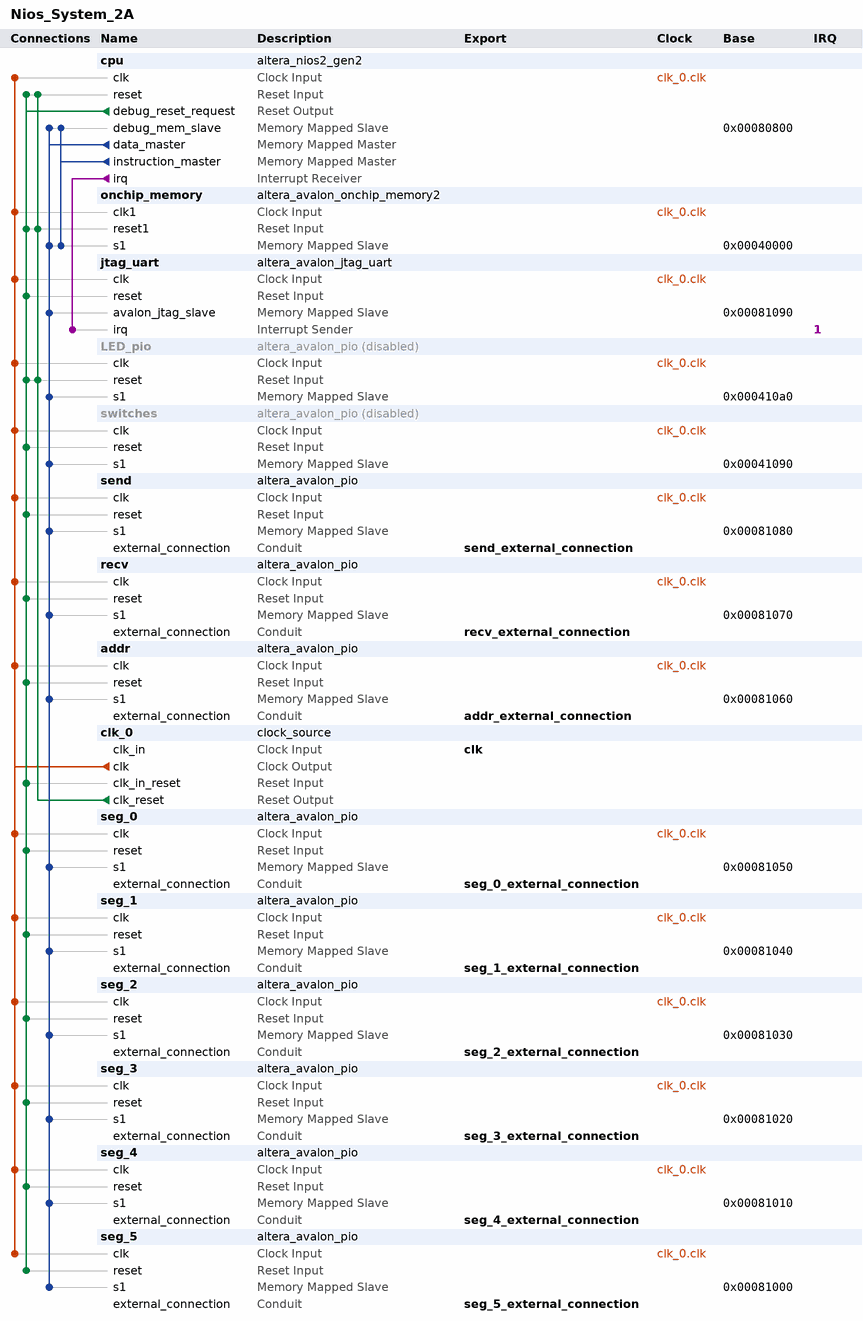
[diagram p0: system contents]
# Platform Designer (Qsys) system Nios_System_2A, Cyclone V 5CSEMA5F31C6
# Parameters at their usual value, and those the tool derives, are not listed.
package require -exact qsys 18.1
create_system Nios_System_2A
set_project_property DEVICE_FAMILY {Cyclone V}
set_project_property DEVICE 5CSEMA5F31C6

add_instance cpu altera_nios2_gen2 18.1
set_instance_parameter_value cpu cpuID 1
set_instance_parameter_value cpu dcache_size 4096
set_instance_parameter_value cpu exceptionSlave onchip_memory.s1
set_instance_parameter_value cpu icache_size 8192
set_instance_parameter_value cpu impl Fast
set_instance_parameter_value cpu resetSlave onchip_memory.s1

add_instance onchip_memory altera_avalon_onchip_memory2 18.1
set_instance_parameter_value onchip_memory dataWidth 32
set_instance_parameter_value onchip_memory dualPort false
set_instance_parameter_value onchip_memory initMemContent true
set_instance_parameter_value onchip_memory initializationFileName onchip_mem.hex
set_instance_parameter_value onchip_memory memorySize 160000

add_instance jtag_uart altera_avalon_jtag_uart 18.1
set_instance_parameter_value jtag_uart simInteractiveOptions NO_INTERACTIVE_WINDOWS

add_instance LED_pio altera_avalon_pio 18.1
set_instance_property LED_pio ENABLED false
set_instance_parameter_value LED_pio direction Output
set_instance_parameter_value LED_pio width 8

add_instance switches altera_avalon_pio 18.1
set_instance_property switches ENABLED false
set_instance_parameter_value switches direction Input
set_instance_parameter_value switches width 8

add_instance send altera_avalon_pio 18.1
set_instance_parameter_value send direction Output
set_instance_parameter_value send width 32

add_instance recv altera_avalon_pio 18.1
set_instance_parameter_value recv direction Input
set_instance_parameter_value recv width 32

add_instance addr altera_avalon_pio 18.1
set_instance_parameter_value addr direction Output
set_instance_parameter_value addr width 8

add_instance clk_0 clock_source 18.1
set_instance_parameter_value clk_0 clockFrequency 50000000

add_instance seg_0 altera_avalon_pio 18.1
set_instance_parameter_value seg_0 direction Output
set_instance_parameter_value seg_0 width 8

add_instance seg_1 altera_avalon_pio 18.1
set_instance_parameter_value seg_1 direction Output
set_instance_parameter_value seg_1 width 8

add_instance seg_2 altera_avalon_pio 18.1
set_instance_parameter_value seg_2 direction Output
set_instance_parameter_value seg_2 width 8

add_instance seg_3 altera_avalon_pio 18.1
set_instance_parameter_value seg_3 direction Output
set_instance_parameter_value seg_3 width 8

add_instance seg_4 altera_avalon_pio 18.1
set_instance_parameter_value seg_4 direction Output
set_instance_parameter_value seg_4 width 8

add_instance seg_5 altera_avalon_pio 18.1
set_instance_parameter_value seg_5 direction Output
set_instance_parameter_value seg_5 width 8

# connections
add_connection clk_0.clk addr.clk clock
add_connection clk_0.clk cpu.clk clock
add_connection clk_0.clk jtag_uart.clk clock
add_connection clk_0.clk LED_pio.clk clock
add_connection clk_0.clk onchip_memory.clk1 clock
add_connection clk_0.clk recv.clk clock
add_connection clk_0.clk seg_0.clk clock
add_connection clk_0.clk seg_1.clk clock
add_connection clk_0.clk seg_2.clk clock
add_connection clk_0.clk seg_3.clk clock
add_connection clk_0.clk seg_4.clk clock
add_connection clk_0.clk seg_5.clk clock
add_connection clk_0.clk send.clk clock
add_connection clk_0.clk switches.clk clock
add_connection clk_0.clk_reset cpu.reset reset
add_connection clk_0.clk_reset LED_pio.reset reset
add_connection clk_0.clk_reset onchip_memory.reset1 reset
add_connection cpu.debug_reset_request addr.reset reset
add_connection cpu.debug_reset_request clk_0.clk_in_reset reset
add_connection cpu.debug_reset_request cpu.reset reset
add_connection cpu.debug_reset_request jtag_uart.reset reset
add_connection cpu.debug_reset_request LED_pio.reset reset
add_connection cpu.debug_reset_request onchip_memory.reset1 reset
add_connection cpu.debug_reset_request recv.reset reset
add_connection cpu.debug_reset_request seg_0.reset reset
add_connection cpu.debug_reset_request seg_1.reset reset
add_connection cpu.debug_reset_request seg_2.reset reset
add_connection cpu.debug_reset_request seg_3.reset reset
add_connection cpu.debug_reset_request seg_4.reset reset
add_connection cpu.debug_reset_request seg_5.reset reset
add_connection cpu.debug_reset_request send.reset reset
add_connection cpu.debug_reset_request switches.reset reset
add_connection cpu.data_master addr.s1 avalon
set_connection_parameter_value cpu.data_master/addr.s1 baseAddress 0x00081060
add_connection cpu.data_master cpu.debug_mem_slave avalon
set_connection_parameter_value cpu.data_master/cpu.debug_mem_slave baseAddress 0x00080800
add_connection cpu.data_master jtag_uart.avalon_jtag_slave avalon
set_connection_parameter_value cpu.data_master/jtag_uart.avalon_jtag_slave baseAddress 0x00081090
add_connection cpu.data_master LED_pio.s1 avalon
set_connection_parameter_value cpu.data_master/LED_pio.s1 baseAddress 0x000410a0
add_connection cpu.data_master onchip_memory.s1 avalon
set_connection_parameter_value cpu.data_master/onchip_memory.s1 baseAddress 0x00040000
add_connection cpu.data_master recv.s1 avalon
set_connection_parameter_value cpu.data_master/recv.s1 baseAddress 0x00081070
add_connection cpu.data_master seg_0.s1 avalon
set_connection_parameter_value cpu.data_master/seg_0.s1 baseAddress 0x00081050
add_connection cpu.data_master seg_1.s1 avalon
set_connection_parameter_value cpu.data_master/seg_1.s1 baseAddress 0x00081040
add_connection cpu.data_master seg_2.s1 avalon
set_connection_parameter_value cpu.data_master/seg_2.s1 baseAddress 0x00081030
add_connection cpu.data_master seg_3.s1 avalon
set_connection_parameter_value cpu.data_master/seg_3.s1 baseAddress 0x00081020
add_connection cpu.data_master seg_4.s1 avalon
set_connection_parameter_value cpu.data_master/seg_4.s1 baseAddress 0x00081010
add_connection cpu.data_master seg_5.s1 avalon
set_connection_parameter_value cpu.data_master/seg_5.s1 baseAddress 0x00081000
add_connection cpu.data_master send.s1 avalon
set_connection_parameter_value cpu.data_master/send.s1 baseAddress 0x00081080
add_connection cpu.data_master switches.s1 avalon
set_connection_parameter_value cpu.data_master/switches.s1 baseAddress 0x00041090
add_connection cpu.instruction_master cpu.debug_mem_slave avalon
set_connection_parameter_value cpu.instruction_master/cpu.debug_mem_slave baseAddress 0x00080800
add_connection cpu.instruction_master onchip_memory.s1 avalon
set_connection_parameter_value cpu.instruction_master/onchip_memory.s1 baseAddress 0x00040000
add_connection cpu.irq jtag_uart.irq interrupt
set_connection_parameter_value cpu.irq/jtag_uart.irq irqNumber 1

# exported interfaces
add_interface addr_external_connection conduit end
set_interface_property addr_external_connection EXPORT_OF addr.external_connection
add_interface clk clock sink
set_interface_property clk EXPORT_OF clk_0.clk_in
add_interface recv_external_connection conduit end
set_interface_property recv_external_connection EXPORT_OF recv.external_connection
add_interface seg_0_external_connection conduit end
set_interface_property seg_0_external_connection EXPORT_OF seg_0.external_connection
add_interface seg_1_external_connection conduit end
set_interface_property seg_1_external_connection EXPORT_OF seg_1.external_connection
add_interface seg_2_external_connection conduit end
set_interface_property seg_2_external_connection EXPORT_OF seg_2.external_connection
add_interface seg_3_external_connection conduit end
set_interface_property seg_3_external_connection EXPORT_OF seg_3.external_connection
add_interface seg_4_external_connection conduit end
set_interface_property seg_4_external_connection EXPORT_OF seg_4.external_connection
add_interface seg_5_external_connection conduit end
set_interface_property seg_5_external_connection EXPORT_OF seg_5.external_connection
add_interface send_external_connection conduit end
set_interface_property send_external_connection EXPORT_OF send.external_connection

set_interconnect_requirement {$system} qsys_mm.clockCrossingAdapter HANDSHAKE
set_interconnect_requirement {$system} qsys_mm.enableEccProtection FALSE
set_interconnect_requirement {$system} qsys_mm.insertDefaultSlave FALSE
set_interconnect_requirement {$system} qsys_mm.maxAdditionalLatency 1

save_system Nios_System_2A.qsys
